# Altium schematic sheet BackUp.SchDoc
size A4
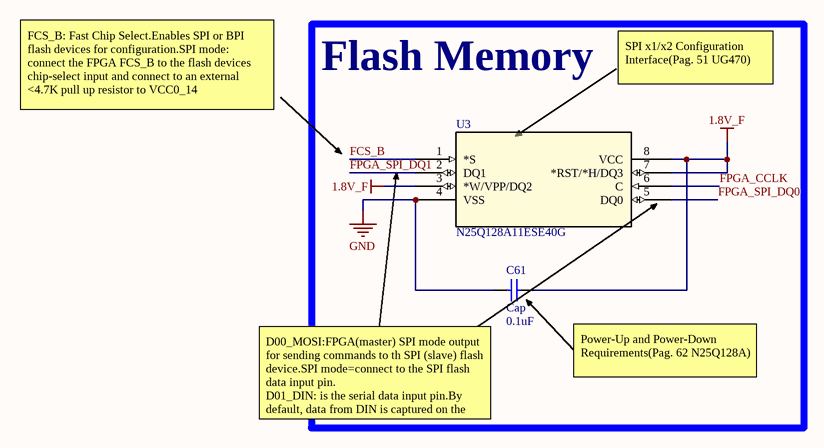
[diagram p0: BackUp.SchDoc]

## Parts
C61  Cap  value 0.1uF  [GRM0402MurataCap]
U3  N25Q128A11ESE40G  [MIC-SOP2-8-SE]

## Blocks framed on the sheet
Flash Memory: C61 U3

## Nets
1.8V_F: C61.1 U3.3(*W/VPP/DQ2) U3.7(*RST/*H/DQ3) U3.8(VCC)
GND: C61.2 U3.4(VSS)
FCS_B: U3.1(*S)
FPGA_CCLK: U3.6(C)
FPGA_SPI_DQ0: U3.5(DQ0)
FPGA_SPI_DQ1: U3.2(DQ1)

## Notes on the sheet
- SPI x1/x2 Configuration Interface(Pag. 51 UG470)
- FCS_B: Fast Chip Select.Enables SPI or BPI flash devices for configuration.SPI mode: connect the FPGA FCS_B to the flash devices chip-select input and connect to an external <4.7K pull up resistor to VCC0_14
- (near C61) D00_MOSI:FPGA(master) SPI mode output for sending commands to th SPI (slave) flash device.SPI mode=connect to the SPI flash data input pin.
  D01_DIN: is the serial data input pin.By default, data from DIN is captured on the rising edge of CCLK. SPI modes:DIN is the fpga data input that recieves serial data from the data source.
- Power-Up and Power-Down Requirements(Pag. 62 N25Q128A)

## Library data of the parts
C61 = Cap: Capacitor; Manufacturer: Murata; PartNumber: GRM155R71C104KA88D; Tolerance: 10%; Costo: 0.1; Descripción: 16V  smd; Vendedor: Mouser; Package: 0402; Link: http://ar.mouser.com/ProductDetail/Murata/GRM155R71C104KA88D/?qs=%2fha2pyFadujIGegxGvwRDvVwOQgIoi4nDRGA%252bvXwE%252b%2fh1BTHKrtK2A%3d%3d; DataSheet: http://www.mouser.com/ds/2/281/c02e-2905.pdf
U3 = N25Q128A11ESE40G: Flash Memory; Vendor: MICRON; C: Copyright (C) 2015 Accelerated Designs. All rights reserved; Costo: 1.62; Vendedor: Avnet; Manufacturer_Part_Number: N25Q128A11ESE40G; Copyright: Copyright (C) 2015 Accelerated Designs. All rights reserved; Value: Value; Type: Type; RefDes: RefDes; DataSheet: https://4donline.ihs.com/images/VipMasterIC/IC/MICT/MICT-S-A0000105325/MICT-S-A0000105325-1.pdf; Descripción: Flash Memory; Link: https://www.avnet.com/shop/apac/p/n25q128a11ese40g-3074457345630128859?CMP=ASIA_FindChips_inventoryfeed_VSE; Manufacturer: Micron; PartNumber: N25Q128A11ESE40G